# Altium project intelGalileoCableCom.PrjPcb
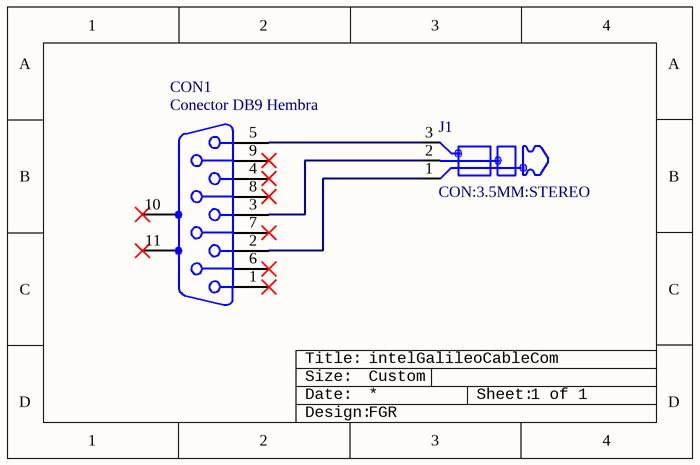
[diagram p0: intelGalileoCableCom.SchDoc]
1 sheet, 3 parts. Net scope: global (net labels, ports and power ports of the same name join across sheets).

## Sheet intelGalileoCableCom.SchDoc: MODULO STEP DOWN
size 96 x 63 mm; SheetNumber: 1; SheetTotal: 1; CurrentDateFGR: 20-03-2018; ModifiedDateFGR: 04-08-2018; PageSetup: Record=PageOptions|CenterHorizontal=True|CenterVertical=True|PrintScale=2.85|XCorrection=1.00|YCorrection=1.00|PrintKind=0|BorderSize=5000000|LeftOffset=0|BottomOffset=0|Orientation=2|PaperLength=1000|PaperWidth=1000|Scale=100|PaperSource=7|PrintQuality=-4|MediaType=1|DitherType=10|PaperKind=Letter|PrintScaleMode=1

### Parts
CON1  Conector DB9 Hembra  [db9_female]
J1  CON:3.5MM:STEREO
ROT?  Rotulo_no_web  (value not drawn)  (graphical)

### Nets
NetCON1_2: CON1.2 J1.1
NetCON1_3: CON1.3 J1.2
NetCON1_5: CON1.5 J1.3

Not connected (* = marked no-connect by the designer): CON1 1* 4* 6* 7* 8* 9* 10(MH1)* 11(MH2)*

### Notes on the sheet
- intelGalileoCableCom
- Custom
- 1 of 1
- FGR
- (in symbol Rotulo_no_web) Title:; Size:; Date:; Sheet:; Design:

### Library data of the parts
J1 = CON:3.5MM:STEREO: Stereo 3.5mm audio connector male
ROT? = Rotulo_no_web: Rotulo [consolas]
CON1 = Conector DB9 Hembra: Price: ?